# Altium schematic sheet OPT.SchDoc
size 74 x 64 mm
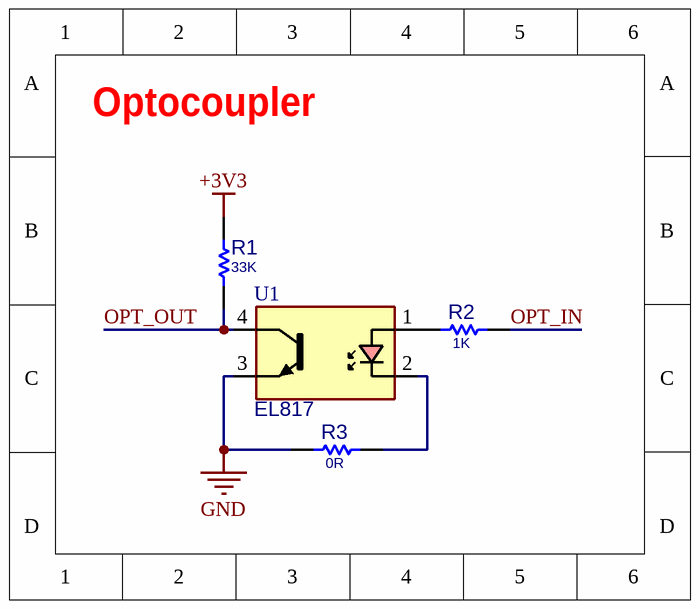
[diagram p0: OPT.SchDoc]

## Parts
R1  33K  [R0603]
R2  1K  [R0603]
R3  0R  [R0603]
U1  EL817  [DIP_4SMD]

## Nets
+3V3: R1.1
GND: R3.2 U1.3(E)
OPT_IN: R2.1
OPT_OUT: R1.2 U1.4(C)
NetR2_2: R2.2 U1.1(A)
NetR3_1: R3.1 U1.2(K)

## Notes on the sheet
- Optocoupler

## Library data of the parts
R1-R3 = RES_SMD: RES, SMD; MANF_P#: RK73H1ETTP4701F; MANF: KOA SPEER; PARAM: 0.063W; DESC: DESCRIPTION; DIST#: MOUSER; PARAM2: 1%; ASSEMBLY: ASSEMBLY; PRICE: 100= 0.5$
  R1: VALUE: 33K
  R2: VALUE: 1K
  R3: VALUE: 0R
U1 = OPTC_TR4P_EL817_SMD: OPTOCOUPLER, TRANSISTOR, 4PIN; PARAM: IF=5mA; PARAM2: VCE = 5V; PRICE: 300t@Paya; VALUE: EL817